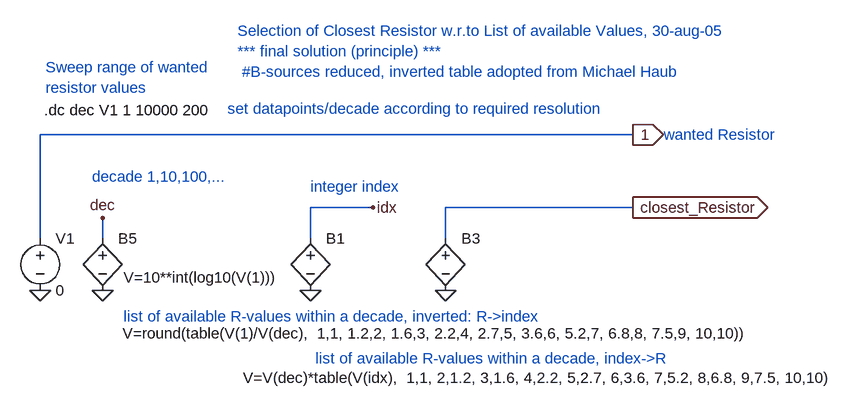
[diagram p0: schematic Select_resistor_from_list_V3.asc]
Select_resistor_from_list_V3.asc, the LTspice schematic file:
Version 4
SHEET 1 1792 680
WIRE 112 128 112 -32
WIRE 208 128 208 96
WIRE 528 128 528 80
WIRE 624 80 528 80
WIRE 736 128 736 80
WIRE 1024 -32 112 -32
WIRE 1024 80 736 80
FLAG 112 208 0
FLAG 528 208 0
FLAG 1024 -32 1
IOPIN 1024 -32 Out
FLAG 624 80 idx
FLAG 736 208 0
FLAG 1024 80 closest_Resistor
IOPIN 1024 80 Out
FLAG 208 208 0
FLAG 208 96 dec
SYMBOL voltage 112 112 R0
WINDOW 123 0 0 Left 0
WINDOW 39 0 0 Left 0
SYMATTR InstName V1
SYMATTR Value 0
SYMBOL bv 528 112 R0
WINDOW 3 -289 162 Left 0
SYMATTR Value V=round(table(V(1)/V(dec),  1,1, 1.2,2, 1.6,3, 2.2,4, 2.7,5, 3.6,6, 5.2,7, 6.8,8, 7.5,9, 10,10))
SYMATTR InstName B1
SYMBOL bv 736 112 R0
WINDOW 3 -312 230 Left 0
SYMATTR Value V=V(dec)*table(V(idx),  1,1, 2,1.2, 3,1.6, 4,2.2, 5,2.7, 6,3.6, 7,5.2, 8,6.8, 9,7.5, 10,10)
SYMATTR InstName B3
SYMBOL bv 208 112 R0
WINDOW 3 32 76 Left 0
SYMATTR Value V=10**int(log10(V(1)))
SYMATTR InstName B5
TEXT 118 -70 Left 0 !.dc dec V1 1 10000 200
TEXT 1072 -32 Left 0 ;wanted Resistor
TEXT 416 -192 Left 0 ;Selection of Closest Resistor w.r.to List of available Values, 30-aug-05\n*** final solution (principle) ***\n #B-sources reduced, inverted table adopted from Michael Haub
TEXT 192 32 Left 0 ;decade 1,10,100,...
TEXT 240 248 Left 0 ;list of available R-values within a decade, inverted: R->index
TEXT 120 -136 Left 0 ;Sweep range of wanted\nresistor values
TEXT 528 48 Left 0 ;integer index
TEXT 536 312 Left 0 ;list of available R-values within a decade, index->R
TEXT 400 -72 Left 0 ;set datapoints/decade according to required resolution

The netlist it stands for:
* Select_resistor_from_list_V3.asc
V1 1 0 0
B1 idx 0 V=round(table(V(1)/V(dec),  1,1, 1.2,2, 1.6,3, 2.2,4, 2.7,5, 3.6,6, 5.2,7, 6.8,8, 7.5,9, 10,10))
B3 closest_Resistor 0 V=V(dec)*table(V(idx),  1,1, 2,1.2, 3,1.6, 4,2.2, 5,2.7, 6,3.6, 7,5.2, 8,6.8, 9,7.5, 10,10)
B5 dec 0 V=10**int(log10(V(1)))
.dc dec V1 1 10000 200
* wanted Resistor
* Selection of Closest Resistor w.r.to List of available Values, 30-aug-05
* *** final solution (principle) ***
*  #B-sources reduced, inverted table adopted from Michael Haub
* decade 1,10,100,...
* list of available R-values within a decade, inverted: R->index
* Sweep range of wanted
* resistor values
* integer index
* list of available R-values within a decade, index->R
* set datapoints/decade according to required resolution
.backanno
.end